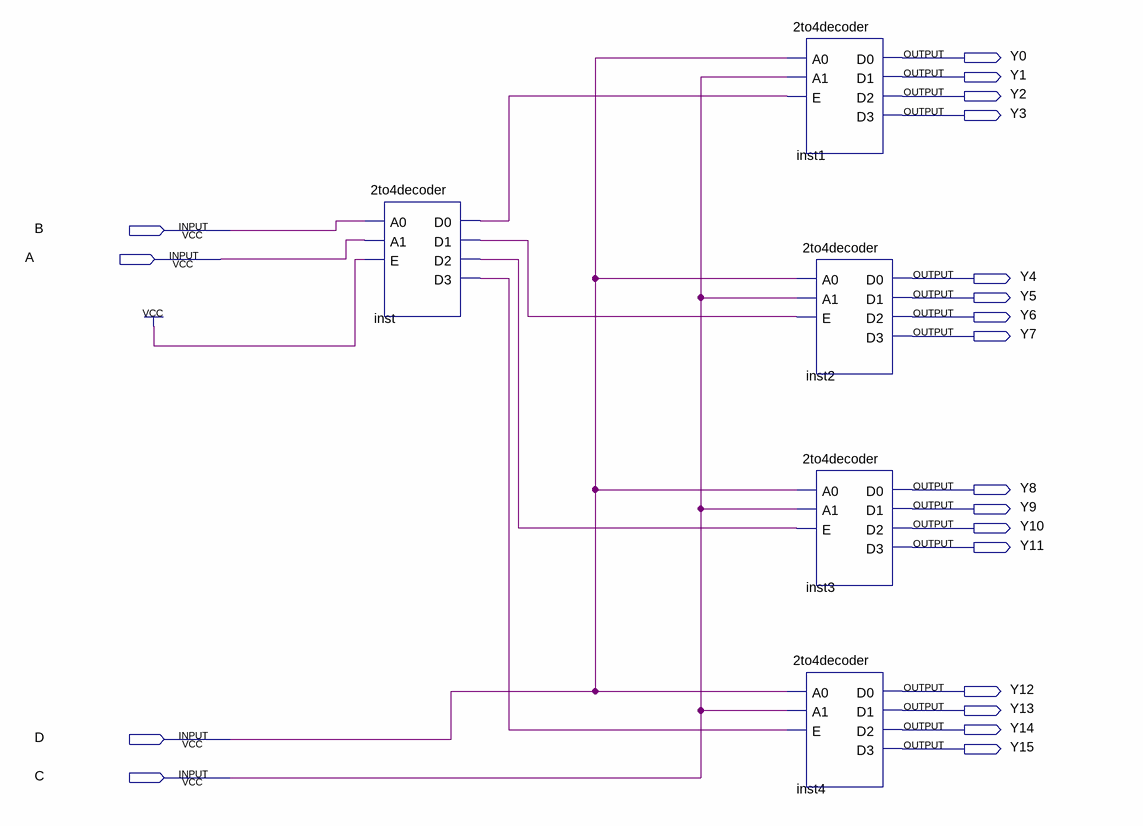
[diagram p0: schematic sheet]
// Quartus schematic 4to16decoder.bdf as structural Verilog: 5 symbols, 20 pins
module \4to16decoder  (
  input  B,
  input  A,
  input  D,
  input  C,
  output Y0,
  output Y1,
  output Y2,
  output Y3,
  output Y4,
  output Y5,
  output Y6,
  output Y7,
  output Y8,
  output Y9,
  output Y10,
  output Y11,
  output Y12,
  output Y13,
  output Y14,
  output Y15
);

  wire inst_d0, inst_d1, inst_d2, inst_d3;

  \2to4decoder  inst (.A0(B), .A1(A), .E(1'b1), .D0(inst_d0), .D1(inst_d1), .D2(inst_d2), .D3(inst_d3));
  \2to4decoder  inst1 (.A0(D), .A1(C), .E(inst_d0), .D0(Y0), .D1(Y1), .D2(Y2), .D3(Y3));
  \2to4decoder  inst2 (.A0(D), .A1(C), .E(inst_d1), .D0(Y4), .D1(Y5), .D2(Y6), .D3(Y7));
  \2to4decoder  inst3 (.A0(D), .A1(C), .E(inst_d2), .D0(Y8), .D1(Y9), .D2(Y10), .D3(Y11));
  \2to4decoder  inst4 (.A0(D), .A1(C), .E(inst_d3), .D0(Y12), .D1(Y13), .D2(Y14), .D3(Y15));
endmodule
